# Altium schematic sheet trafficLight.SchDoc
size A
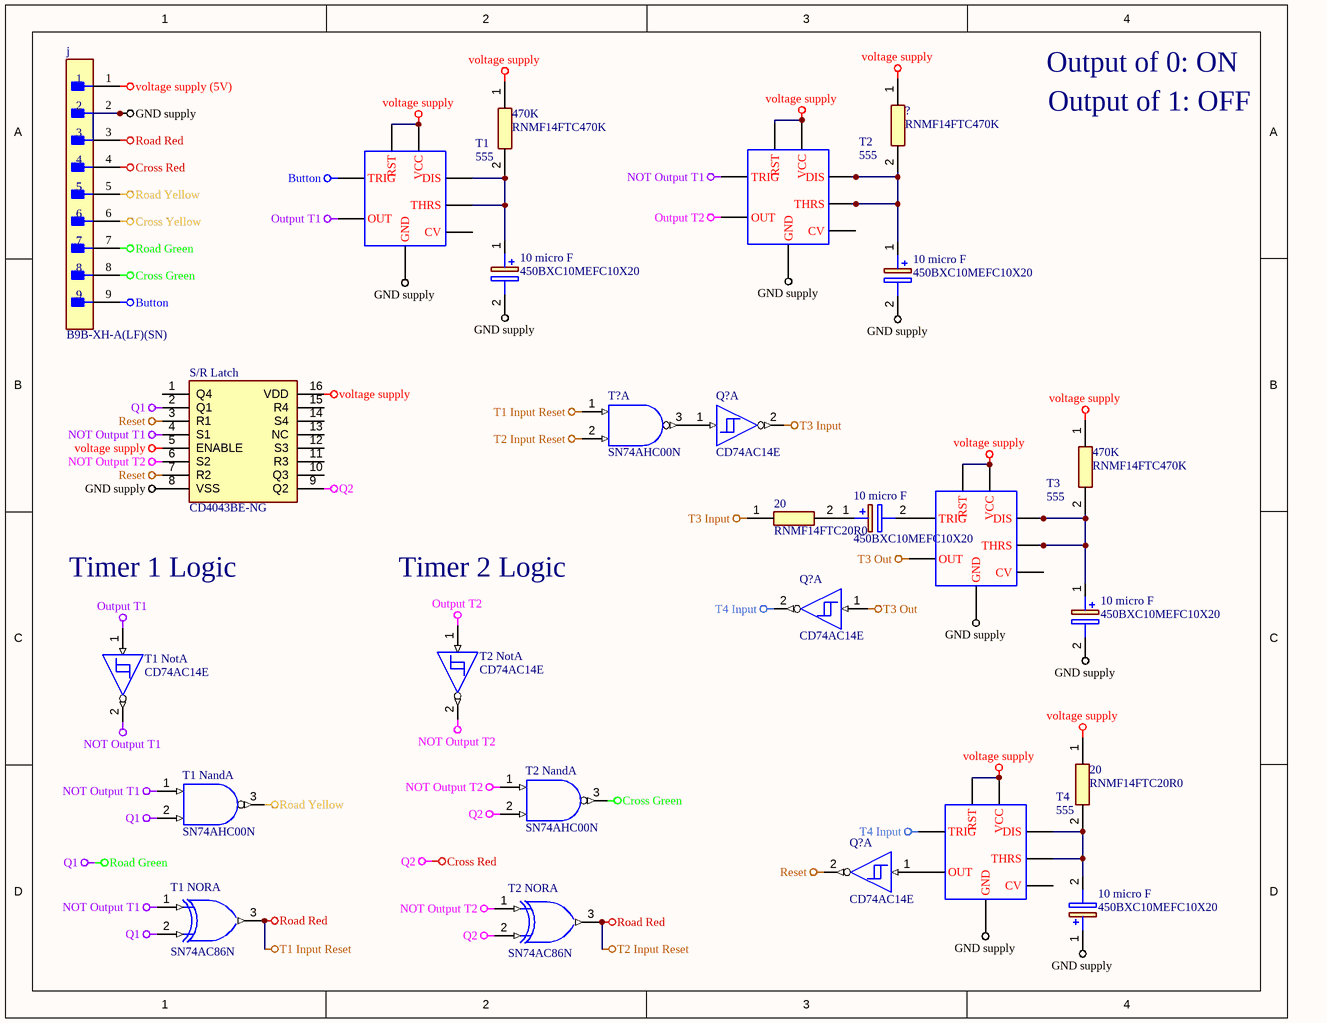
[diagram p0: trafficLight.SchDoc]

## Parts
(Parts that share a designator on the sheet are numbered #1, #2 ... from top to bottom, then left to right.)
10_micro_F#1  450BXC10MEFC10X20  [CAPPRD500W60D1025H2200]
10_micro_F#2  450BXC10MEFC10X20  [CAPPRD500W60D1025H2200]
10_micro_F#3  450BXC10MEFC10X20  [CAPPRD500W60D1025H2200]
10_micro_F#4  450BXC10MEFC10X20  [CAPPRD500W60D1025H2200]
10_micro_F#5  450BXC10MEFC10X20  [CAPPRD500W60D1025H2200]
20#1  RNMF14FTC20R0  [RESAD1042W49L330D178]
20#2  RNMF14FTC20R0  [RESAD1042W49L330D178]
470K#1  RNMF14FTC470K  [RESAD1042W49L330D178]
470K#2  RNMF14FTC470K  [RESAD1042W49L330D178]
?  RNMF14FTC470K  [RESAD1042W49L330D178]
j  B9B-XH-A(LF)(SN)  [FP-B9B-XH-A_LF_SN-MFG]
Q?#1  CD74AC14E  [N0014A]  (part A of 7)
Q?#2  CD74AC14E  [N0014A]  (part A of 7)
Q?#3  CD74AC14E  [N0014A]  (part A of 7)
S/R_Latch  CD4043BE-NG  [DIP794W53P254L1930H508Q16N]
T1  555
T1_Nand  SN74AHC00N  [N0014A]  (part A of 5)
T1_NOR  SN74AC86N  [N0014A]  (part A of 5)
T1_Not  CD74AC14E  [N0014A]  (part A of 7)
T2  555
T2_Nand  SN74AHC00N  [N0014A]  (part A of 5)
T2_NOR  SN74AC86N  [N0014A]  (part A of 5)
T2_Not  CD74AC14E  [N0014A]  (part A of 7)
T3  555
T4  555
T?  SN74AHC00N  [N0014A]  (part A of 5)

## Nets
Button: j.9 T1.2(TRIG)
Cross Green: j.8 T2_Nand.3(1Y)
Cross Red: j.4 S/R_Latch.9(Q2) T2_Nand.2(1B) T2_NOR.2(1B)  [also labelled Q2]
Cross Yellow: j.6
GND supply: 10_micro_F#1.2(-) 10_micro_F#2.2(-) 10_micro_F#4.2(-) 10_micro_F#5.1(+) j.2 S/R_Latch.8(VSS) T1.1(GND) T2.1(GND) T3.1(GND) T4.1(GND)
NOT Output T1: S/R_Latch.4(S1) T1_Nand.1(1A) T1_NOR.1(1A) T1_Not.2(~{1Y}) T2.2(TRIG)
NOT Output T2: S/R_Latch.6(S2) T2_Nand.1(1A) T2_NOR.1(1A) T2_Not.2(~{1Y})
Output T1: T1.3(OUT) T1_Not.1(1A)
Output T2: T2.3(OUT) T2_Not.1(1A)
Q1: j.7 S/R_Latch.2(Q1) T1_Nand.2(1B) T1_NOR.2(1B)  [also labelled Road Green]
Reset: Q?#3.2(~{1Y}) S/R_Latch.3(R1) S/R_Latch.7(R2)
Road Red: j.3 T1_NOR.3(1Y) T2_NOR.3(1Y) T?.1(1A) T?.2(1B)  [also labelled T1 Input Reset, T2 Input Reset]
Road Yellow: j.5 T1_Nand.3(1Y)
T3 Input: 20#1.1 Q?#1.2(~{1Y})
T3 Out: Q?#2.1(1A) T3.3(OUT)
T4 Input: Q?#2.2(~{1Y}) T4.2(TRIG)
voltage supply: 20#2.1 470K#1.1 470K#2.1 ?.1 S/R_Latch.5(ENABLE) S/R_Latch.16(VDD) T1.4(RST) T1.8(VCC) T2.4(RST) T2.8(VCC) T3.4(RST) T3.8(VCC) T4.4(RST) T4.8(VCC)
voltage supply (5V): j.1
Net10_micro_F#1_1: 10_micro_F#1.1(+) 470K#1.2 T1.6(THRS) T1.7(DIS)
Net10_micro_F#2_1: 10_micro_F#2.1(+) ?.2 T2.6(THRS) T2.7(DIS)
Net10_micro_F#3_1: 10_micro_F#3.1(+) 20#1.2
Net10_micro_F#3_2: 10_micro_F#3.2(-) T3.2(TRIG)
Net10_micro_F#4_1: 10_micro_F#4.1(+) 470K#2.2 T3.6(THRS) T3.7(DIS)
Net10_micro_F#5_2: 10_micro_F#5.2(-) 20#2.2 T4.6(THRS) T4.7(DIS)
NetQ?#1_1: Q?#1.1(1A) T?.3(1Y)
NetQ?#3_1: Q?#3.1(1A) T4.3(OUT)

Not connected (* = marked no-connect by the designer): S/R_Latch 1(Q4) 10(Q3) 11(R3) 12(S3) 13(NC) 14(S4) 15(R4); T1 5(CV); T2 5(CV); T3 5(CV); T4 5(CV)

## Notes on the sheet
- Output of 0: ON
- Output of 1: OFF
- Timer 1 Logic
- Timer 2 Logic
- DWG. NO.
- REV.
- SHT.
- REVISION
- DESCRIPTION
- DATE
- APPROVED
- THIS DOCUMENT AND THE DATA DISCLOSED HEREIN OR HEREWITH IS THE PROPERTY OF ALTIUM LIMITED AND MAY BE FREELY DISTRIBUTED IN WHOLE. NO RIGHTS ARE RESERVED OR EXPRESS OR IMPLIED WARANTEE GIVEN.
- ENG:
- DSN:
- APPROVALS
- PROJECT
- DOCUMENT REVISION:
- DESIGN ITEM:
- CHK:
- BOM:
- REFERENCE DOCUMENTS
- PROJECT REVISION:
- TITLE
- FAB DWG:
- PCB DWG:
- ASSY DWG:
- SCALE:
- SIZE
- C
- CAGE CODE
- FILE NAME
- DWG NO.
- SHEET
- OF
- REV

## Library data of the parts
10_micro_F#1-10_micro_F#5 = 450BXC10MEFC10X20: Capacitor Polarised; Manufacturer_Name: Rubycon; Datasheet Link: http://www.rubycon.co.jp/en/catalog/e_pdfs/aluminum/e_bxc.pdf; Height: 22mm; Manufacturer_Part_Number: 450BXC10MEFC10X20; Arrow Part Number: 450BXC10MEFC10X20; Arrow Price/Stock: https://www.arrow.com/en/products/450bxc10mefc10x20/rubycon?region=nac
20#1 20#2 = RNMF14FTC20R0: Resistor; Manufacturer_Name: Stackpole Electronics; Datasheet Link: https://cs.seielect.com/catalog/SEI-RNF_RNMF.pdf; Manufacturer_Part_Number: RNMF14FTC20R0
470K#1 470K#2 ? = RNMF14FTC470K: Resistor; Manufacturer_Name: Stackpole Electronics; Datasheet Link: https://cs.seielect.com/catalog/SEI-RNF_RNMF.pdf; Manufacturer_Part_Number: RNMF14FTC470K
j = CMP-17439-000168-1: CONN HEADER VERT 9POS 2.5MM; Wire/Cable Gauge: 22AWG; Current Rating: 3A; Insulation Resistance: 1GR; Mated Stacking Heights: 9.8mm; Max Voltage Rating (AC): 250V; Contact Resistance: 20mR; Gender: Male; Number of Contacts: 9; Orientation: Straight; Contact Finish - Mating: TIN; Number of Rows: 1; Max Operating Temperature: 85°C; Contact Plating: Tin; Flammability Rating: UL94 V-0; Length: 24.9mm; REACH SVHC: No SVHC; Depth: 5.75mm; Housing Color: White; Package Quantity: 250; Lead Pitch: 2.5mm; Connector Type: Header; Voltage Rating (AC): 250V; Packaging: Bulk; Color: Natural; Min Operating Temperature: -25°C; Insulation Color: Natural; Insulation Material: Nylon; Voltage Rating: 250V; Pitch: 2.5mm; Lead Free: Lead Free; Contact Shape: Square; Housing Material: Polyamide; Series: XH; Termination: Solder; Contact Type: Male Pin; Mount: Through Hole; Max Current Rating: 3A; Number of Positions: 9; Contact Material: Brass; Fastening Type: Detent
Q?#1-Q?#3 T1_Not T2_Not = CMP-1615-00885-3: Hex Schmitt-Triggered Inverters, N0014A, TUBE; Manufacturer: Texas Instruments; Rating: Catalog; Voltage(Nom)(V): 5; Output Type: CMOS; tpd @ Nom Voltage(Max)(ns): 9.5; Bits(#): 6; Technology Family: AC; VCC(Min)(V): 1.5; ICC @ Nom Voltage(Max)(mA): 0.04; F @ Nom Voltage(Max)(Mhz): 100; VCC(Max)(V): 5.5; Schmitt Trigger: Yes; Output Drive (IOL/IOH)(Max)(mA): -24/24; PackageReference: N0014A; Operating Temperature Range(C): -55 to 125; Generic Part Number: CD74AC14; Code_JEDEC: MS-001; Input Type: CMOS; DatasheetVersion: SCHS228B
S/R_Latch = CD4043BE-NG: Integrated Circuit; Manufacturer_Name: Texas Instruments; Datasheet Link: https://www.ti.com/lit/gpn/cd4043b; Height: 5.08mm; Manufacturer_Part_Number: CD4043BE-NG
T1-T4 = 555: Timer 555; SimulationGenericComponent: True
T1_Nand T2_Nand T? = CMP-1627-00451-2: Quadruple 2-Input Positive-NAND Gates, N0014A, TUBE; Manufacturer: Texas Instruments; tpd @ Nom Voltage(Max)(ns): 13,8.5; Output Drive (IOL/IOH)(Max)(mA): 50/-50; Output Type: CMOS; Rating: Catalog; VCC(Min)(V): 2; F @ Nom Voltage(Max)(Mhz): 110; Technology Family: AHC; Voltage(Nom)(V): 3.3,5; ICC @ Nom Voltage(Max)(mA): 0.02; Schmitt Trigger: No; Bits(#): 4; VCC(Max)(V): 5.5; DatasheetVersion: SCLS227J; Operating Temperature Range(C): -40 to 125; PackageReference: N0014A; Input Type: CMOS; Code_JEDEC: MS-001; Generic Part Number: SN74AHC00
T1_NOR T2_NOR = CMP-0778-00101-3: Quadruple 2-Input Exclusive-OR Gates, N0014A, TUBE; Manufacturer: Texas Instruments; Output Type: CMOS; Output Drive (IOL/IOH)(Max)(mA): 24/-24; Bits(#): 4; ICC @ Nom Voltage(Max)(mA): 0.02; Schmitt Trigger: No; VCC(Max)(V): 5.5; tpd @ Nom Voltage(Max)(ns): 12.5,9; F @ Nom Voltage(Max)(Mhz): 100; VCC(Min)(V): 2; Technology Family: AC; Voltage(Nom)(V): 3.3,5; Rating: Catalog; Generic Part Number: SN74AC86; Operating Temperature Range(C): -40 to 85; PackageReference: N0014A; DatasheetVersion: SCAS533C; Input Type: CMOS